# EAGLE design DFN6-15-23-A (EAGLE 6.5.0)
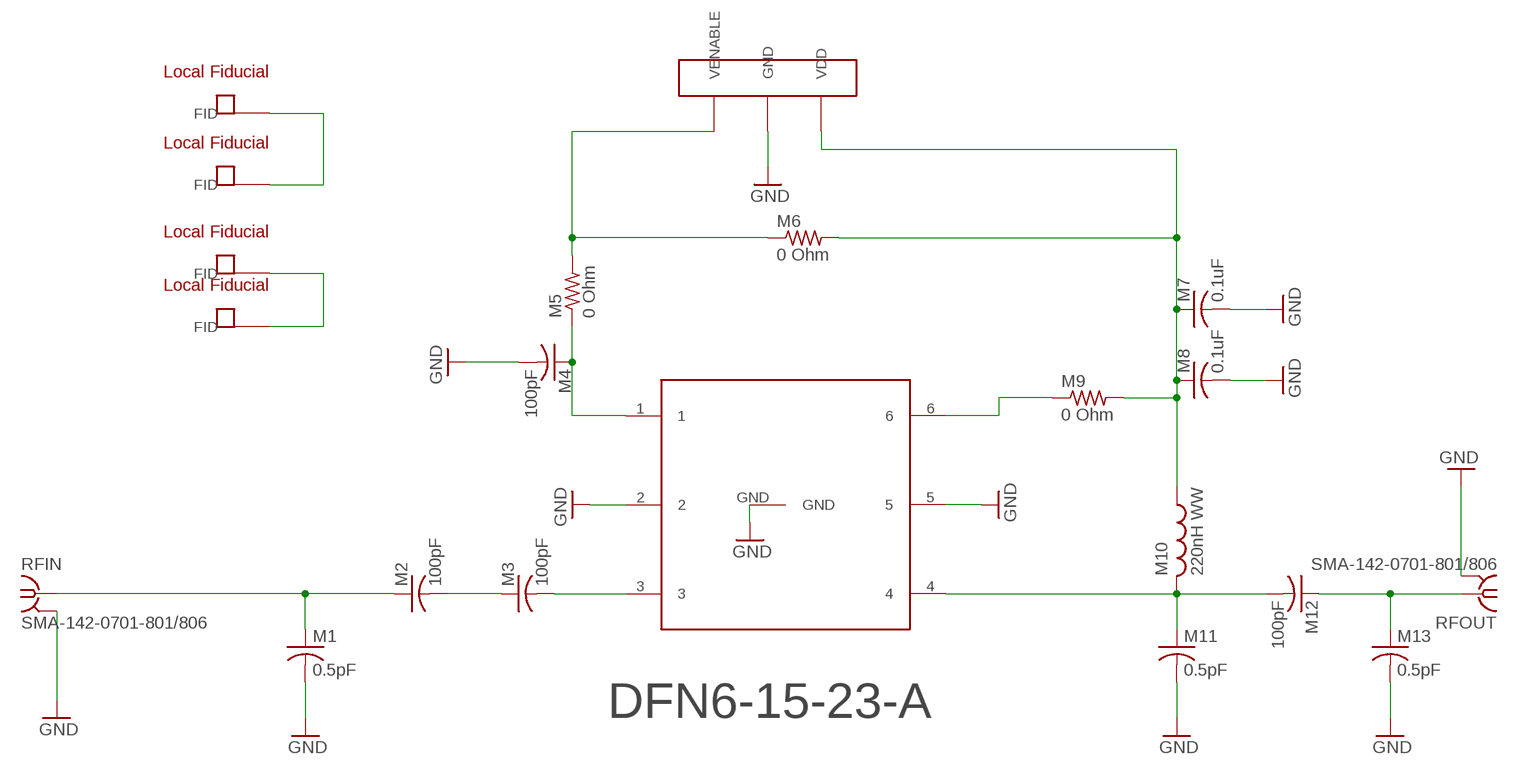
[diagram p0: schematic, sheet 1]

## Parts
FID  GRF_LOCAL_FIDUCIAL  [GRF_LOCAL_FIDUCIAL]
FID@1  GRF_LOCAL_FIDUCIAL  [GRF_LOCAL_FIDUCIAL]
J1  MOLEX_KK_HEADER_3-PIN_0.100-INCH  [MOLEX_KK_HEADER_3-PIN_0.100-INCH]
M1  0.5pF  RCL_C-US_GRF  [RCL_C0402_GRF]
M2  100pF  RCL_C-US_GRF  [RCL_C0402_GRF]
M3  100pF  RCL_C-US_GRF  [RCL_C0402_GRF]
M4  100pF  C-USC0402  [C0402]
M5  0 Ohm  R-US_R0402  [R0402]
M6  0 Ohm  R-US_R0402  [R0402]
M7  0.1uF  C-USC0402  [C0402]
M8  0.1uF  C-USC0402  [C0402]
M9  0 Ohm  R-US_R0402  [R0402]
M10  220nH WW  L-USL0402  [L0402]
M11  0.5pF  RCL_C-US_GRF  [RCL_C0402_GRF]
M12  100pF  RCL_C-US_GRF  [RCL_C0402_GRF]
M13  0.5pF  RCL_C-US_GRF  [RCL_C0402_GRF]
RFIN  SMA-142-0701-801/806  [J502-ND-142-0701-801/806]
RFOUT  SMA-142-0701-801/806  [J502-ND-142-0701-801/806]
U$1  DFN-6_GENERICUPDATED  [DFN-6_1.5X1.5MM_FIXED]
U$2  GRF_LOCAL_FIDUCIAL  [GRF_LOCAL_FIDUCIAL]
U$3  GRF_LOCAL_FIDUCIAL  [GRF_LOCAL_FIDUCIAL]

## Nets
FID [FID]: FID.FID FID@1.FID
FID1 [FID]: U$2.FID U$3.FID
GND: J1.GND M1.2 M4.2 M7.2 M8.2 M11.2 M13.2 RFIN.G@1 RFIN.G@2 RFIN.G@3 RFIN.G@4 RFOUT.G@1 RFOUT.G@2 RFOUT.G@3 RFOUT.G@4 U$1.2 U$1.5 U$1.GND
N$1 [RFIN]: M3.2 U$1.3
N$2 [POWER]: J1.VENABLE M5.2 M6.1
N$3 [RFIN]: M1.1 M2.1 RFIN.1
N$4 [POWER]: M4.1 M5.1 U$1.1
N$5 [RFOUT]: M10.2 M11.1 M12.2 U$1.4
N$6 [RFOUT]: M12.1 M13.1 RFOUT.1
N$7: M9.1 U$1.6
N$8 [POWER]: J1.VDD M6.2 M7.1 M8.1 M9.2 M10.1
N$9 [RFIN]: M2.2 M3.1

## Notes on the sheet
- DFN6-15-23-A

## Library data of the parts
FID FID@1 U$2 U$3 = GuerrillaRF:GRF_LOCAL_FIDUCIAL
J1 = GuerrillaRF:MOLEX_KK_HEADER_3-PIN_0.100-INCH
M1-M3 M11-M13 = GRF400X_RevA:RCL_C-US_GRF
M4 M7 M8 = rcl:C-US: CAPACITOR, American symbol
M5 M6 M9 = rcl:R-US_: RESISTOR, American symbol
M10 = rcl:L-US: INDUCTOR, American symbol
RFIN RFOUT = con-coax:SMA-: SMA 50 Ohm End Launch Jack Receptacle - Round Contact Johnson Components Source: www.johnsoncomponents.com .. J502-ND.pdf; MF: JOHNSON COMPONENTS; MPN: 142-0701-801; OC_FARNELL: 1608592; OC_NEWARK: 90F2624
U$1 = GuerrillaRF:DFN-6_GENERIC

## Net classes
0 default: clearance 0.178 mm
1 RFIN: clearance 0.508 mm to class 0
2 RFOUT: clearance 0.508 mm to class 0
3 POWER: clearance 0.254 mm to class 0
4 FID: width 0.762 mm, drill 0.762 mm, clearance 0.762 mm to class 0, clearance 0.762 mm to class 1, clearance 0.762 mm to class 2, clearance 0.762 mm to class 3, clearance 0.762 mm

## Board
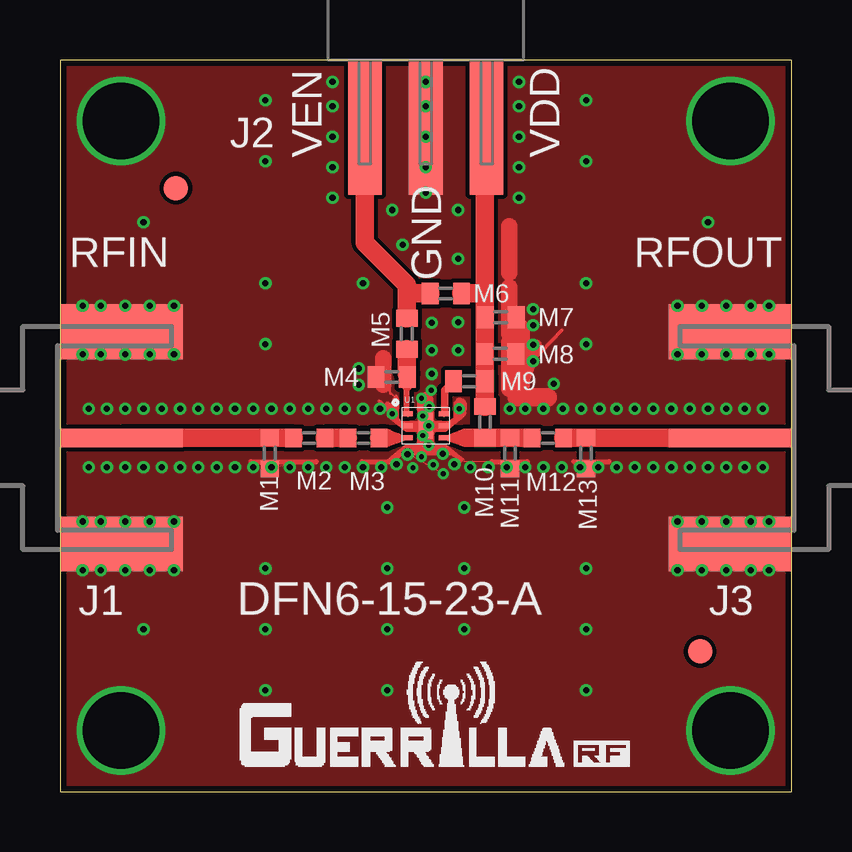
[diagram p1: board, top side]
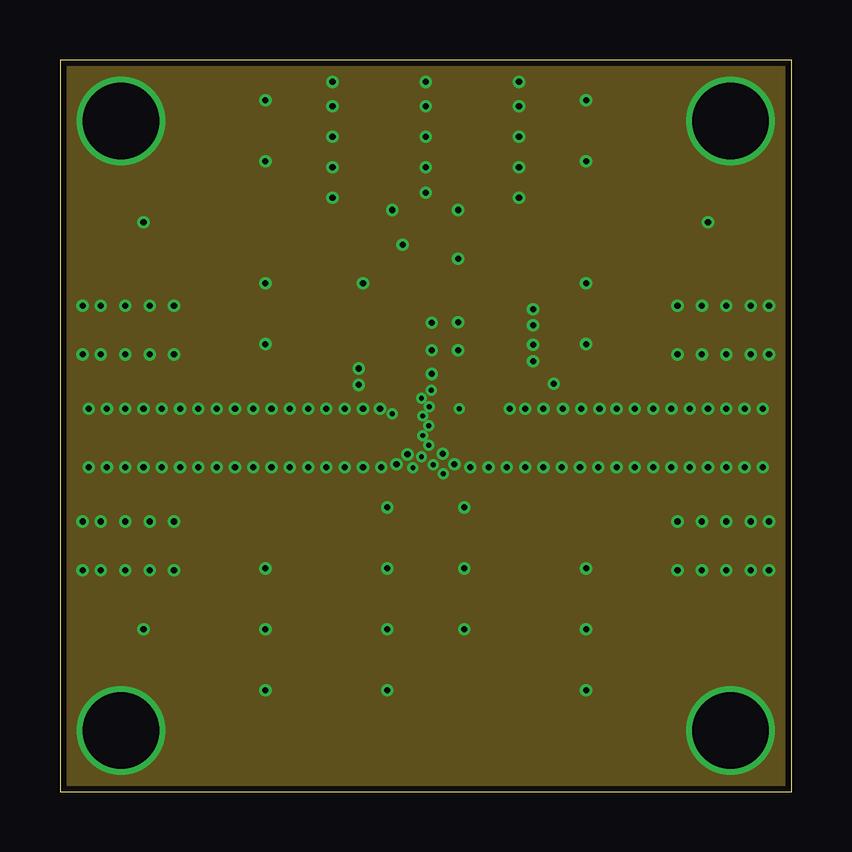
[diagram p2: board, inner layer Route2]
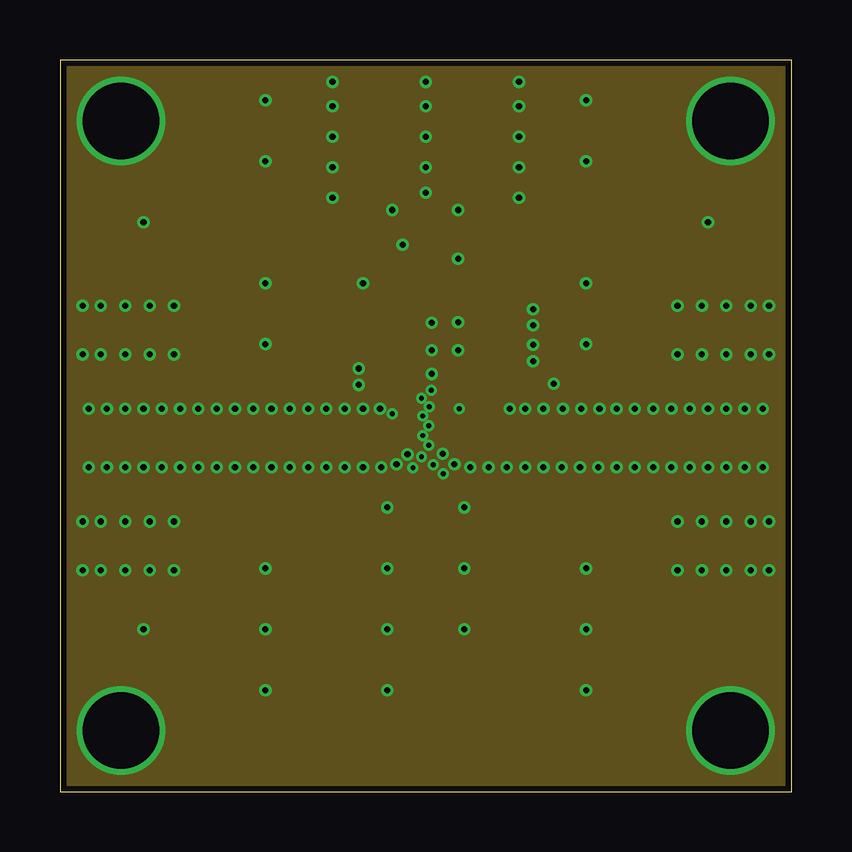
[diagram p3: board, inner layer Route15]
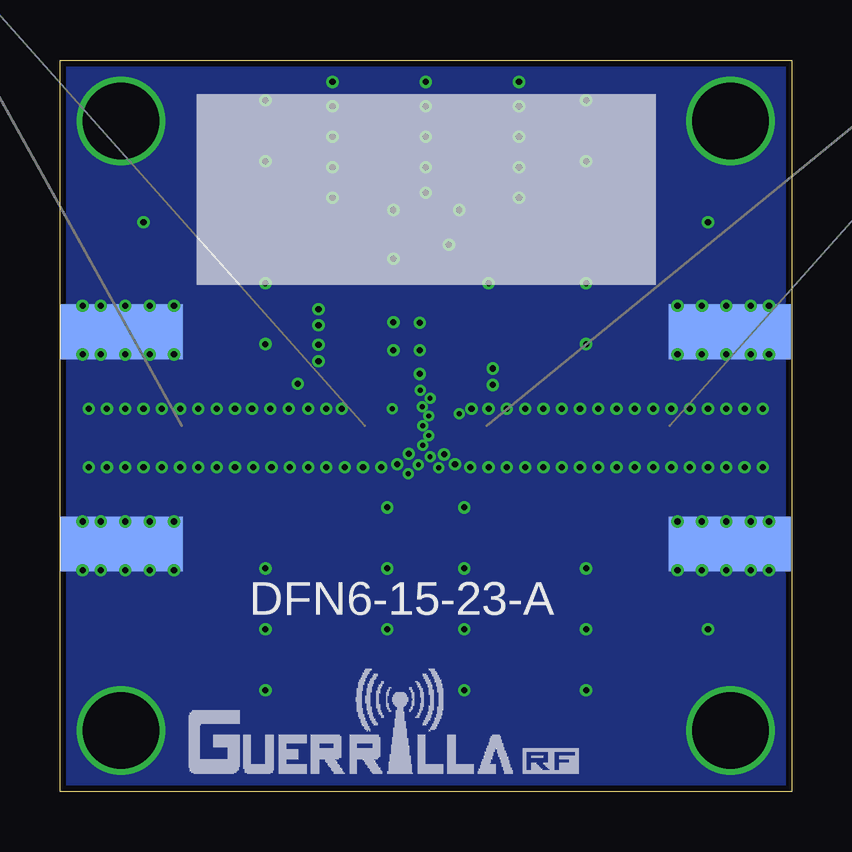
[diagram p4: board, bottom side, seen from below]

Size 30.48 x 30.48 mm. Coordinates in mm from the lower left corner, seen from the top.
Outline: 0,0 30.48,0 30.48,30.48 0,30.48 0,0
Copper layers (1*2*15*16): Top 0.035559375mm / dielectric 16mil / Route2 0.035559375mm / dielectric 24mil / Route15 0.035559375mm / dielectric 16mil / Bottom 0.035559375mm
Design rules "Eugene_Design_Rules_rev2": minimum track width 1mil, minimum drill 8mil, track to track 6mil, track to pad 4mil, pad to pad 4mil, via to via 4mil, smd to smd 0mil, copper to edge 10mil, drill to drill 8mil, minimum pad ring 5mil, minimum via ring 5mil, stop-mask expansion 0mil, vias tented up to drill 10mil, thermal gap 0mil

### Footprints (pad centres in the part's own frame; a part is rotated, then mirrored left to right if it is on the bottom)
GRF_LOCAL_FIDUCIAL = smd 1.016 x 1.016: FID 0,0
MOLEX_KK_HEADER_3-PIN_0.100-INCH = smd 1.397 x 5.588: GND 0,-2.819; VDD 2.54,-2.819; VENABLE -2.54,-2.819
RCL_C0402_GRF = smd 0.686 x 0.762: 1 -0.65,0; 2 0.65,0
C0402 = smd 0.7 x 0.9: 1 -0.65,0; 2 0.65,0
R0402 = smd 0.7 x 0.9: 1 -0.65,0; 2 0.65,0
L0402 = smd 0.7 x 0.9: 1 -0.65,0; 2 0.65,0
J502-ND-142-0701-801/806 = smd 5.08 x 0.762: 1 2.565,0 | smd 5.08 x 2.286: G@1 2.565,4.42; G@2 2.565,-4.42 | smd 5.08 x 2.286 bottom: G@3 2.565,4.42; G@4 2.565,-4.42
DFN-6_1.5X1.5MM_FIXED = smd 0.4 x 0.2: 1 -0.75,0.5; 2 -0.75,0; 3 -0.75,-0.5; 4 0.75,-0.5; 5 0.75,0; 6 0.75,0.5 | smd 0.6 x 1.1: GND 0,0

### Placement (x,y rotation side)
DRILEGEND  [DRILEGEND]  -3.78,-49.17 0 top  (outside the outline)
FID  26.67,5.84 0 top
FID@1  26.67,5.84 0 top
J1  15.24,30.48 0 top
M1  8.74,14.1 270 top
M2  10.39,14.73 0 top
M3  12.65,14.73 0 top
M4  13.82,17.27 180 top
M5  14.45,19.08 90 top
M6  16.08,20.75 0 top
M7  18.36,19.76 0 top
M8  18.34,18.24 0 top
M9  17.04,17.09 0 top
M10  17.7,15.39 270 top
M11  18.75,14.1 270 top
M12  20.32,14.73 180 top
M13  21.92,14.1 270 top
RFIN  0,14.73 0 top
RFOUT  30.48,14.73 180 top
U$1  15.24,15.24 0 top
U$2  4.83,25.15 0 top
U$3  4.83,25.15 0 top

### Tracks (layer width: path | path; a pad name or v marks a point on that pad's centre or on a via)
GND  (via drill 0.2, 0.25, 3.17)
  Top 0.025: 14.12,15.6 14.12,15.65 | 14.12,15.65 14.12,16.23 | 14.12,16.23 14.12,16.28 13.96,16.45 13.46,16.94 13.44,16.97 | 14.11,15.53 14.12,15.53 14.12,15.6 | 14.28,15.42 14.28,15.39 14.25,15.39 14.25,15.37 14.22,15.37 14.22,15.34 | 14.43,15.27 14.43,15.24 14.4,15.24 | 13.31,16.26 13.31,16.18 13.39,16.08 | 14.99,15.27 15.21,15.27 U$1.GND | 14.12,15.6 14.02,15.6 | 13.97,15.8 13.97,15.65 14.12,15.65 | 14.07,16.23 14.12,16.23 | 14.02,16.13 14.02,16 13.97,16 | 16.46,15.65 16.23,15.42 16.31,15.42
  Top 0.051: 13.34,16.15 13.39,16.08 14.33,15.14 14.43,15.14 | 14.43,15.14 14.5,15.14 | 14.5,15.14 16.13,15.14 16.15,15.14 16.85,15.68 | 14.4,15.24 14.25,15.39 14.11,15.53 13.39,16.26 | 14.28,15.42 16.31,15.42 16.69,15.77 | 16.08,14.45 15.24,14.45 14.4,14.45 13.67,13.85 | 13.67,13.85 13.64,13.82 | 16.08,14.45 16.84,13.82 16.84,13.74 17.98,13.74 | 13.64,15.65 14.4,15.01 16.08,15.01 16.84,15.65 16.64,15.65 16.64,15.9 | 14.43,15.11 14.43,15.14 | 14.5,15.11 14.5,15.14 | 14.2,14.07 14.3,14.07 14.3,14.15 14.3,14.28 14.3,14.3 14.35,14.3 | 14.38,14.15 v15.98,13.23 | 13.74,13.74 13.72,13.74 13.72,13.79 13.67,13.79 13.67,13.85 | 10.69,13.74 9.98,13.74 M1.2 | 16.08,14.4 16.08,14.45 | 16.23,14.15 16.28,14.15 | 16.82,15.77 16.64,15.9 | 16.64,15.9 16.64,15.93 v16.64,15.95 | 21.39,13.74 21.67,13.74 v21.67,13.51 | 18.72,16.79 18.75,16.79 v18.75,15.95 | 19.2,16.76 19.2,19.28 | 16.2,15.34 16.24,15.34 16.24,15.3 | U$1.2 14.48,15.27 | 13.99,16.48 13.96,16.45 13.77,16.56
  Top 0.076: 13.77,16.56 13.77,17.14
  Top 0.102: 16.08,14.4 14.4,14.4
  Top 0.127: 13.92,16.38 14.07,16.23 | 13.97,16 13.82,16.15 | 16.46,15.65 16.46,16.2 16.89,16.18 | 13.72,13.79 14.3,14.28 | 13.99,16.48 14.07,16.28
  Top 0.152: 14.3,15.27 14.22,15.34 | 14.22,15.34 13.31,16.26 | 14.22,15.34 14.53,15.34 | 14.22,15.37 14.33,15.37 | 16.13,15.14 16.13,15.21 16.13,15.24 U$1.5 v15.37,15.24 U$1.GND 15.23,15.37 | 16.13,15.14 16.82,15.77 | 16.13,15.14 15.24,15.34 | 20.9,19.23 19.18,17.4 | 16.2,15.34 15.44,15.34
  Top 0.203: 14.02,15.6 14.02,16.13 | 16.59,15.82 16.59,16.1 16.69,16.2 16.69,16.15 | 16.69,15.93 16.69,15.77 | 12.57,13.74 13.74,13.74 | 17.98,13.74 19.48,13.74 | 21.39,13.74 22.89,13.74 | 14.35,14.3 16.13,14.3 | 16.28,14.15 16.69,13.82 | 14.02,13.92 14.2,14.07 | 14.5,15.11 16.08,15.11 | 13.77,15.67 14.43,15.11 | 7.95,13.74 10.69,13.74
  Top 0.254: 13.97,15.8 13.64,16.13 | 16.69,16.2 16.69,16.26 | 16.13,15.21 16.24,15.3 16.82,15.77
  Top 0.305: 14.43,15.27 14.48,15.27 14.99,15.27 | 16.64,16.26 16.64,15.93 | 14.3,14.15 14.38,14.15 16.23,14.15
  Top 0.381: 16.71,15.8 16.69,16.15 16.66,15.98
  Top 0.508: U$1.GND 15.47,15.27 | 16.69,16.15 16.69,15.93 | 19.2,16.94 19.23,16.94 | 19.84,18.59 19.2,16.76
  Top 0.686: 15.21,16.31 15.24,15.39 | 13.46,18.06 13.46,16.94 | 18.72,16.79 18.72,18.72 | 18.72,19.07 18.72,21.01 | 18.72,21.61 18.72,23.55
  Top 0.711: 15.24,14.45 15.24,14.96
  Top 0.762: 19.02,16.43 20.32,16.43 | 19.2,16.94 19.2,19.28
  other vias: 15.47,16.71 15.06,16.38 15.39,16.03 15.11,15.65 15.11,14.83 15.37,14.43 15.06,13.94 15.54,13.61 13.84,15.75 13.34,15.95 12.62,15.95 11.86,15.95 11.1,15.95 10.34,15.95 9.58,15.95 8.81,15.95 8.05,15.95 7.29,15.95 6.53,15.95 5.77,15.95 5,15.95 4.24,15.95 3.48,15.95 2.72,15.95 1.96,15.95 1.19,15.95 1.19,13.51 1.96,13.51 2.72,13.51 3.48,13.51 4.24,13.51 5,13.51 7.29,13.51 8.05,13.51 8.81,13.51 9.58,13.51 11.1,13.51 11.86,13.51 12.62,13.51 13.39,13.51 29.29,15.95 28.52,15.95 27.76,15.95 27,15.95 26.24,15.95 25.48,15.95 24.71,15.95 23.95,15.95 23.19,15.95 22.48,15.95 20.14,15.95 19.38,15.95 29.29,13.51 28.52,13.51 27.76,13.51 27,13.51 26.24,13.51 25.48,13.51 24.71,13.51 23.95,13.51 23.19,13.51 22.43,13.51 20.9,13.51 19.38,13.51 18.62,13.51 17.86,13.51 17.09,13.51 16.43,13.64 25.73,18.21 26.75,18.21 27.76,18.21 28.78,18.21 25.73,20.24 26.75,20.24 27.76,20.24 28.78,20.24 25.73,11.25 26.75,11.25 25.73,9.22 26.75,9.22 27.76,9.22 27.76,11.25 28.78,9.22 28.78,11.25 4.75,11.25 3.73,11.25 2.72,11.25 1.7,11.25 1.7,9.22 2.72,9.22 3.73,9.22 4.75,9.22 4.75,20.24 3.73,20.24 2.72,20.24 1.7,20.24 4.75,18.21 3.73,18.21 2.72,18.21 1.7,18.21 29.54,11.25 29.54,9.22 29.54,18.21 29.54,20.24 0.94,11.25 0.94,9.22 0.94,18.21 0.94,20.24 12.45,16.94 12.45,17.63 11.35,24.74 11.35,26.01 11.35,27.28 11.35,28.55 11.35,29.57 19.71,20.09 19.13,24.74 19.13,26.01 19.13,27.28 19.13,28.55 19.13,29.57 13.84,24.23 16.59,24.23 16.59,22.2 16.59,18.39 15.24,29.57 15.24,28.55 15.24,27.28 15.24,26.01 15.24,24.94 21.92,28.8 8.56,9.3 13.64,9.3 13.64,6.76 13.64,4.22 8.56,4.22 16.84,6.76 16.84,9.3 16.84,11.84 21.92,4.22 21.92,26.26 21.92,21.18 27,23.72 3.48,23.72 8.56,26.26 8.56,21.18 8.56,28.8 20.57,16.99 14.71,13.49 15.95,14.07 14.48,14.05 14.02,13.64 27.94,2.54 2.54,2.54 2.54,27.94 27.94,27.94 20.14,13.51 10.34,13.51 8.56,6.76 3.48,6.76 21.92,6.76 15.49,18.39 15.49,17.4 21.72,15.95 20.95,15.95 19.71,19.43 14.27,22.78 12.62,21.18 5.77,13.51 6.53,13.51 19.71,17.93 19.71,18.62 15.49,19.53 16.59,19.56 13.64,11.84 21.92,9.3 8.56,18.64 21.92,18.64
  pour Bottom: -0.76,30.99 31.24,30.99 31.24,-0.76 -0.76,-0.76
  pour Top: -1.27,31.5 32,31.5 32,-1.78 -1.27,-1.78
  pour Route2: -1.78,32 33.02,32 33.02,-2.79 -1.78,-2.79
  pour Route15: -2.29,32.77 34.04,32.77 34.04,-3.81 -2.29,-3.81
N$1
  Top 0.051: 13.39,15.09 13.56,14.73 13.39,14.38 13.64,14.38 14.4,14.66 | 13.64,15.09 14.4,14.81 14.4,14.73 U$1.3 | 14.33,14.71 U$1.3 | 14.33,14.74 U$1.3
  Top 0.178: 14.07,14.73 U$1.3 | 14.33,14.71 14.11,14.62 | 14.15,14.81 14.33,14.74
  Top 0.406: 13.74,14.73 14.07,14.73
  Top 0.635: 13.56,14.73 13.74,14.73
  Top 0.762: 13.56,14.73 M3.2
N$2
  Top 0.762: M5.2 14.45,20.75 | 14.45,20.75 14.45,21.11 12.7,22.86 J1.VENABLE | M6.1 14.45,20.75
N$3
  Top 0.051: M2.1 8.74,14.73 M1.1
  Top 0.762: M2.1 RFIN.1
N$4
  Top 0.254: U$1.1 14.45,15.75 14.45,16.87
  Top 0.406: 14.45,16.87 14.45,17.41 M4.1
  Top 0.762: 14.45,17.41 M5.1
N$5
  Top 0.025: 17.09,15.09 16.74,14.73
  Top 0.051: 16.08,14.66 16.84,14.38 17.09,14.38 17.09,15.09 16.84,15.09 16.08,14.81
  Top 0.203: U$1.4 16.36,14.73
  Top 0.254: 17.79,14.84 M11.1 17.83,14.63 17.75,14.63 17.8,14.66 17.78,14.62 | 16.36,14.73 16.38,14.73
  Top 0.305: 17.79,14.84 17.53,14.73
  Top 0.356: 16.36,14.73 16.51,14.73
  Top 0.406: M10.2 17.68,14.82 17.68,14.68 | 16.66,14.73 16.74,14.73
  Top 0.457: 16.51,14.73 16.66,14.73
  Top 0.61: M11.1 M10.2
  Top 0.635: 16.74,14.73 16.92,14.73
  Top 0.762: 16.92,14.73 17.53,14.73 M12.2
N$6
  Top 0.254: M12.1 M13.1
  Top 0.762: M12.1 RFOUT.1
N$7
  Top 0.254: U$1.6 16,15.8 16.03,15.82
  Top 0.305: 16.03,15.82 16.03,16.73 M9.1
N$8
  Top 0.051: 17.7,16.94 17.71,17.88 M7.1 | 17.7,17.27 17.69,17.27 M8.1 | M9.2 17.7,17.09
  Top 0.762: M10.1 17.7,16.94 17.7,17.09 17.7,17.27 17.7,20.75 | 17.7,20.75 17.7,27.66 J1.VDD | M6.2 17.7,20.75
N$9
  Top 0.762: M3.1 M2.2

### Text on the board
Top: Top Copper
Route2: Metal Layer 2 Ground Plane
Route15: Metal Layer 3 Ground Plane
Bottom: Bottom Copper
tNames: J2 | VEN | VDD | GND | J1 | DFN6-15-23-A | J3 | Top Silkscreen
bNames: DFN6-15-23-A | Bottom Silkscreen
tStop: Top Soldermask
bStop: Bottom Soldermask
tCream: Solder Paste Top
bCream: Solder Paste Bottom
Drills: Drill Drawing
bDocu: REV | Description | Date | 1 | Initial release | 09/08/2017 | Required files: / See Readme | Note A: | Note A: | Specifications: / All units are in inches unless otherwise specified. / 1. Materials / Beginning foil thickness 1/2oz min. but shall meet the minimum requirements below: / Layer 1 - Top Layer, 1 oz copper, 0.0014 / Dielectric - Rogers 4003, 0.016 +/- 0.0006 / Layer 2 - Ground Plane, 1 oz copper, 0.0014 / Dielectric - Fr4, (adjust this layer to meet thickness target) / Layer 3 - Ground Plane, 1 oz copper, 0.0014 / Dielectric - Rogers 4003, 0.016 +/- 0.0006 / Layer 4 - Bottom Layer, 1 oz copper, 0.0014 / / Total Board Thickness = 0.062 +/- 0.005 including top and bottom soldermask. / / 2. Hole Plating / Copper plate 0.0010/0.0015 thick in Thru Hole Vias (Approx. 0.0015 on surface). / / 3. Finish / ENIG / Thickness 3-8 micro inches. / Solder Mask / Liquid Photo Imagable (LPI) Solder Mask Over Bare Copper (SMOBC) on Both Sides of PCB. / Color: Red or Approved Equal. / Silkscreen: White Non-Conductive Epoxy Ink. / Supplier ID and Lot Number shall be noted on bottom silkscreen. / 4. Tolerances / Overall board dimension tolerance +/- 0.010. / Hole Diameter >= 0.100 +/- 0.005. / Hole Diameter < 0.100 +/- 0.003. / Layer to layer registration should be +/- 0.001. / All holes shall be located within hole to pad tangency. / 5. Traces / Conductors indicated as Note A shall be 0.030 +/- 0.001 wide and have a coplanar / ground spacing of 0.020 +/- 0.001 Manufacturer shall test for lines indicated to be / 50 Ohm +/- 5% and may adjust the width as needed. / Minimum conductor width is 0.007 +/- 0.001. / Minimum conductor to conductor spacing is 0.006. / TDR coupon required to be delivered with boards. / The controlled impedance on layer 1 shall be 50 Ohms +/- 5%. | SIZE | DOCUMENT NO. | REV | Dimensions are in inches unless / otherwise specified. | A | DFN6-15-23 | Date: | Drawn By: Eugenio M. Proenza | SCALE NONE | Sheet 1 of 1 | 09/08/2017